# Altium schematic sheet MCU.SchDoc
size A4; SheetNumber: 4; SheetTotal: 4
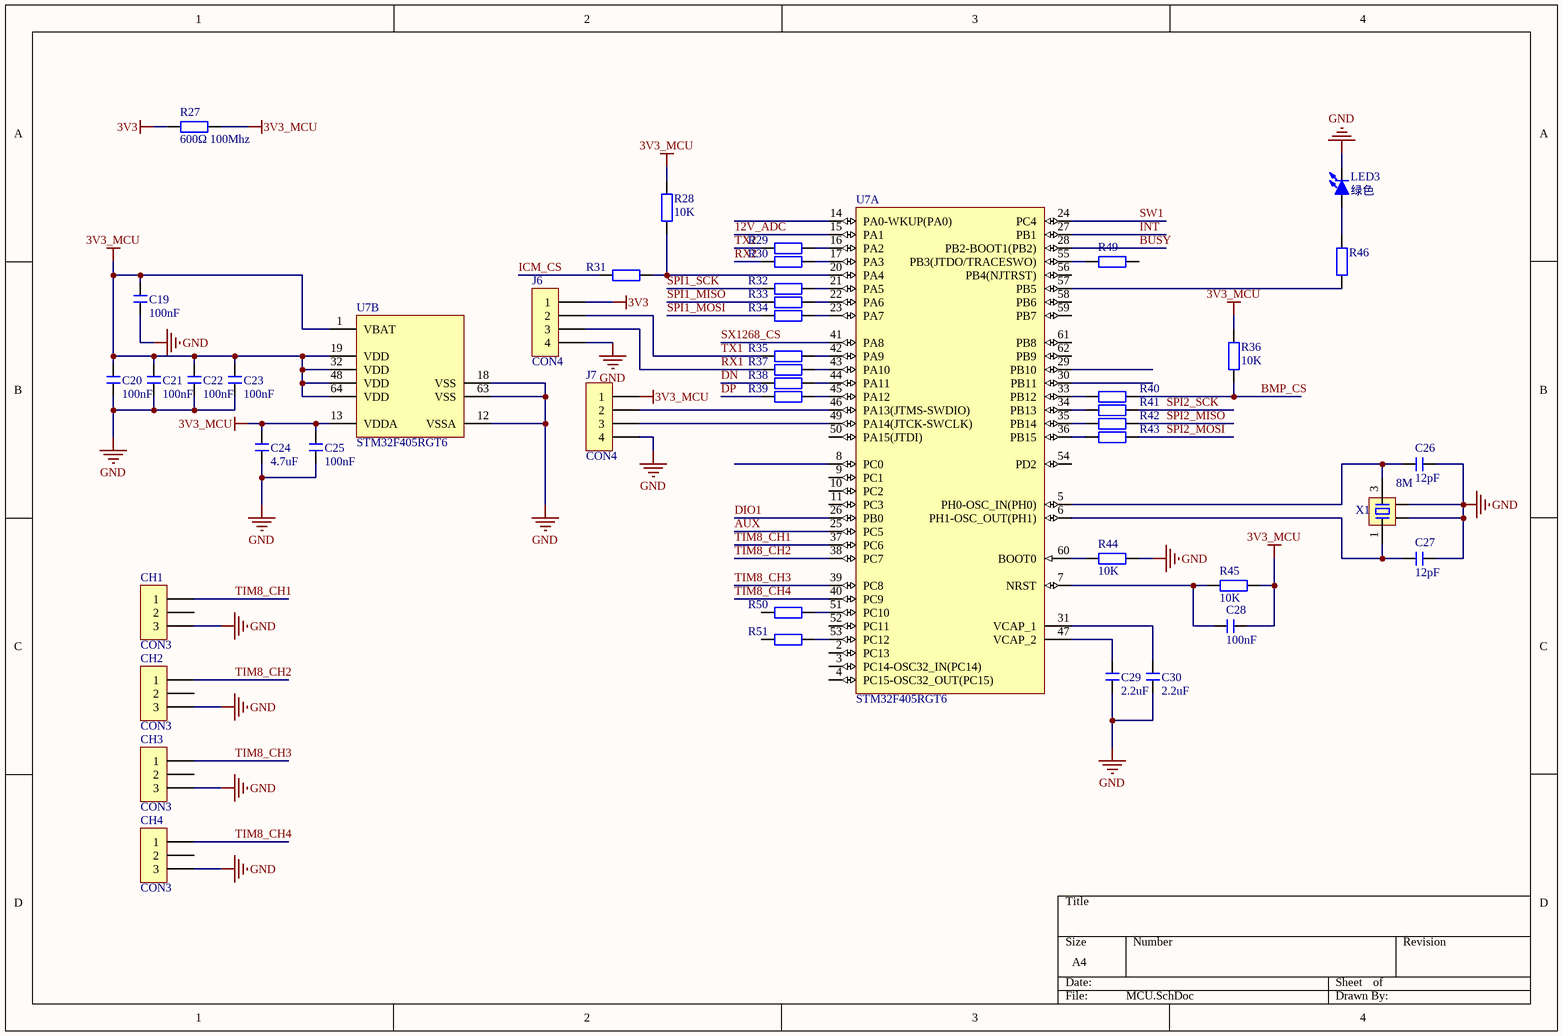
[diagram p0: MCU.SchDoc]

## Parts
C19  100nF  [C 0603_L]
C20  100nF  [C 0603_L]
C21  100nF  [C 0603_L]
C22  100nF  [C 0603_L]
C23  100nF  [C 0603_L]
C24  4.7uF  [C 0603_L]
C25  100nF  [C 0603_L]
C26  12pF  [C 0603_L]
C27  12pF  [C 0603_L]
C28  100nF  [C 0603_L]
C29  2.2uF  [C 0603_L]
C30  2.2uF  [C 0603_L]
CH1  CON3  [HDR2.54-LI-3P]
CH2  CON3  [HDR2.54-LI-3P]
CH3  CON3  [HDR2.54-LI-3P]
CH4  CON3  [HDR2.54-LI-3P]
J6  CON4  [HDR2.54-LI-4P]
J7  CON4  [HDR2.54-LI-4P]
LED3  绿色  [LED 0805G]
R27  600Ω 100Mhz  [R 0805_L]
R28  10K  [R 0603_L]
R29  (no value)  [R 0603_L]
R30  (no value)  [R 0603_L]
R31  (no value)  [R 0603_L]
R32  (no value)  [R 0603_L]
R33  (no value)  [R 0603_L]
R34  (no value)  [R 0603_L]
R35  (no value)  [R 0603_L]
R36  10K  [R 0603_L]
R37  (no value)  [R 0603_L]
R38  (no value)  [R 0603_L]
R39  (no value)  [R 0603_L]
R40  (no value)  [R 0603_L]
R41  (no value)  [R 0603_L]
R42  (no value)  [R 0603_L]
R43  (no value)  [R 0603_L]
R44  10K  [R 0603_L]
R45  10K  [R 0603_L]
R46  (no value)  [R 0603_L]
R49  (no value)  [R 0603_L]
R50  (no value)  [R 0603_L]
R51  (no value)  [R 0603_L]
U7  STM32F405RGT6  [STM-LQFP64_N]  (parts A,B of 2)
X1  8M  [OSC 3225-4P]

## Nets
3V3: J6.1 R27.1
3V3_MCU: C19.2 C20.2 C21.2 C22.2 C23.2 C24.2 C25.2 C28.1 J7.1 R27.2 R28.2 R36.2 R45.2 U7.1(VBAT) U7.13(VDDA) U7.19(VDD) U7.32(VDD) U7.48(VDD) U7.64(VDD)
GND: C19.1 C20.1 C21.1 C22.1 C23.1 C24.1 C25.1 C26.1 C27.1 C29.1 C30.1 CH1.3 CH2.3 CH3.3 CH4.3 J6.4 J7.4 LED3.2(K) R44.2 U7.12(VSSA) U7.18(VSS) U7.63(VSS) X1.2 X1.4
12V_ADC: U7.15(PA1)
AUX: U7.25(PC5)
BMP_CS: R36.1 R40.2
BUSY: U7.28(PB2-BOOT1(PB2))
DIO1: U7.26(PB0)
DN: R38.2
DP: R39.2
ICM_CS: R31.2
INT: U7.27(PB1)
RX1: J6.3 R37.2
RX2: R30.2
SPI1_MISO: R33.2
SPI1_MOSI: R34.2
SPI1_SCK: R32.2
SPI2_MISO: R42.2
SPI2_MOSI: R43.2
SPI2_SCK: R41.2
SW1: U7.24(PC4)
SX1268_CS: U7.41(PA8)
TIM8_CH1: CH1.1 U7.37(PC6)
TIM8_CH2: CH2.1 U7.38(PC7)
TIM8_CH3: CH3.1 U7.39(PC8)
TIM8_CH4: CH4.1 U7.40(PC9)
TX1: J6.2 R35.2
TX2: R29.2
NetC26_2: C26.2 U7.5(PH0-OSC_IN(PH0)) X1.3
NetC27_2: C27.2 U7.6(PH1-OSC_OUT(PH1)) X1.1
NetC28_2: C28.2 R45.1 U7.7(NRST)
NetC29_2: C29.2 U7.47(VCAP_2)
NetC30_2: C30.2 U7.31(VCAP_1)
NetJ7_2: J7.2 U7.46(PA13(JTMS-SWDIO))
NetJ7_3: J7.3 U7.49(PA14(JTCK-SWCLK))
NetLED3_1: LED3.1(A) R46.2
NetR28_1: R28.1 R31.1 U7.20(PA4)
NetR29_1: R29.1 U7.16(PA2)
NetR30_1: R30.1 U7.17(PA3)
NetR32_1: R32.1 U7.21(PA5)
NetR33_1: R33.1 U7.22(PA6)
NetR34_1: R34.1 U7.23(PA7)
NetR35_1: R35.1 U7.42(PA9)
NetR37_1: R37.1 U7.43(PA10)
NetR38_1: R38.1 U7.44(PA11)
NetR39_1: R39.1 U7.45(PA12)
NetR40_1: R40.1 U7.33(PB12)
NetR41_1: R41.1 U7.34(PB13)
NetR42_1: R42.1 U7.35(PB14)
NetR43_1: R43.1 U7.36(PB15)
NetR44_1: R44.1 U7.60(BOOT0)
NetR46_1: R46.1 U7.57(PB5)
NetR49_1: R49.1 U7.55(PB3(JTDO/TRACESWO))
NetR50_1: R50.1 U7.51(PC10)
NetR51_1: R51.1 U7.53(PC12)

Not connected (* = marked no-connect by the designer): CH1 2; CH2 2; CH3 2; CH4 2; R49 2; R50 2; R51 2; U7 2(PC13) 3(PC14-OSC32_IN(PC14)) 4(PC15-OSC32_OUT(PC15)) 8(PC0) 9(PC1) 10(PC2) 11(PC3) 14(PA0-WKUP(PA0)) 29(PB10) 30(PB11) 50(PA15(JTDI)) 52(PC11) 54(PD2) 56(PB4(NJTRST)) 58(PB6) 59(PB7) 61(PB8) 62(PB9)

## Library data of the parts
C19-C30 = C: 无极性贴片电容; 版权归属: 源创客; BOM名称: 无极性贴片电容; 学习资源: www.ooocke.com
CH1-CH4 = CON3: Connector
J6 J7 = CON4: Connector
LED3 = LED-SMD: 贴片LED; 版权归属: 源创客; BOM名称: 贴片LED; 学习资源: www.ooocke.com
R27 = R: 磁珠; BOM名称: 贴片电阻; 版权归属: 源创客; 学习资源: www.ooocke.com
R28-R46 R49-R51 = R: 贴片电阻; 版权归属: 源创客; BOM名称: 贴片电阻; 学习资源: www.ooocke.com
U7 = STM32F405RGT6: ARM Cortex-M4 32-bit MCU+FPU, 210 DMIPS, 1024 kB Flash, 192 kB Internal RAM, 51 I/Os, 64-pin LQFP, -40 to 85 degC, Tray; Manufacturer: STMicroelectronics; D/A Converter: 2x12-bit; FLASH Size (Prog) (kB): 1024; I/Os (High Current): 51; Internal RAM Size (kB): 192; Operating Frequency(F) (Processor speed) (MHz): 168; Supply Voltage(Vcc) max (V): 3.6; Supply Voltage(Vcc) min (V): 1.8; DatasheetVersion: Rev. 4; PackageVersion: Rev. 4, 06/2013; PackageReference: LQFP64; PackageDescription: 64-Pin Low Profile Quad Flat Package, 10 x 10 mm Body, 0.5 mm Pitch; Supplier 1: Digi-Key; Supplier Part Number 1: 497-11767-ND; Supplier 2: Farnell; Supplier Part Number 2: 2064363; Supplier 3: Newark; Supplier Part Number 3: 73T2329; Supplier 4: Mouser; Supplier Part Number 4: 511-STM32F405RGT6; Core: ARM Cortex-M4; Packing: Tray; Mounting Technology: Surface Mount; PartNumber: STM32F405RGT6; ComponentLink1Description: Manufacturer URL; ComponentLink1URL: http://www.st.com/web/en/home.html; ComponentLink2Description: Datasheet; ComponentLink2URL: http://www.st.com/st-web-ui/static/active/en/resource/technical/document/datasheet/DM00037051.pdf; ComponentLink3Description: Package Specification; ComponentLink3URL: http://www.st.com/st-web-ui/static/active/en/resource/technical/document/datasheet/DM00037051.pdf
X1 = XTAL-4P: X32258MOB4SI                        全国产 贴片金属 频点：8MHZ 负载：12PF 常温频差：±10PPM 工作温度：-40~85℃ 型号升级变更为：XL2EL89COI-111YLC-8M                                              C2682775; BOM名称: 4脚无源晶振; 版权归属: 源创客; 学习资源: www.ooocke.com